# EAGLE design hand_foot_forearm_leg_LED (EAGLE 7.3.0)
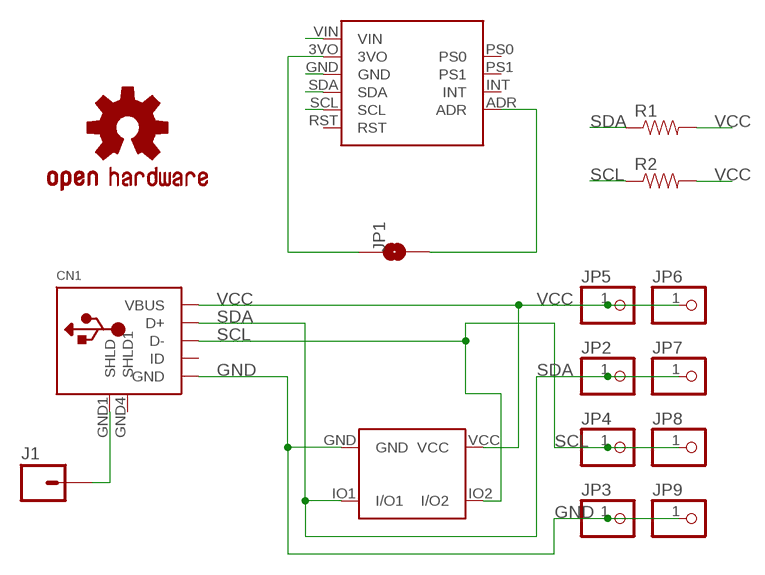
[diagram p0: schematic, sheet 1]

## Parts
CN1  USB  [USB-MINIB-THM-MOLEX_NOSLK]
J1  M01PTH  [1X01]
JP1  JUMPER-PAD-2-NO  [PAD-JUMPER-2-NO_NO_SILK]
JP2  PINHD-1X1CB  [1X01-CLEANBIG]
JP3  PINHD-1X1CB  [1X01-CLEANBIG]
JP4  PINHD-1X1CB  [1X01-CLEANBIG]
JP5  PINHD-1X1CB  [1X01-CLEANBIG]
JP6  PINHD-1X1CB  [1X01-CLEANBIG]
JP7  PINHD-1X1CB  [1X01-CLEANBIG]
JP8  PINHD-1X1CB  [1X01-CLEANBIG]
JP9  PINHD-1X1CB  [1X01-CLEANBIG]
LOGO1  OSHW-LOGOS  [OSHW-LOGO-S]
R1  RESISTORAXIAL-0.3  [AXIAL-0.3]
R2  RESISTORAXIAL-0.3  [AXIAL-0.3]
U$1  BNO_055_BKOUT  [BNO_BKOUT]
U$2  TVS_ARRAY_CD143A  [SOT-143]

## Nets
GND: CN1.GND JP3.1 JP9.1 U$1.GND U$2.GND
N$1: JP1.1 U$1.3VO
N$2: JP1.2 U$1.ADR
SCL: CN1.D- JP4.1 JP8.1 R2.P$1 U$1.SCL U$2.IO2(I/O2)
SDA: CN1.D+ JP2.1 JP7.1 R1.P$1 U$1.SDA U$2.IO1(I/O1)
SHIELD: CN1.GND1(SHLD) J1.1
VCC: CN1.VBUS JP5.1 JP6.1 R1.P$2 R2.P$2 U$1.VIN U$2.VCC
Unconnected: CN1.GND4(SHLD1) CN1.ID U$1.INT U$1.PS0 U$1.PS1 U$1.RST

## Library data of the parts
CN1 = adafruit:USB: USB Connectors USBMINIB - Surface Mount Female Mini-B USB Connector 4UConnector: 06564 By microbuilder.eu Thru-hole RA Female Mini-B USB Connector 4UConnector: 18732 By ladyada.net
J1 = SparkFun-Connectors:M01: Header 1 Standard 1-pin 0.1" header. Use with straight break away headers (SKU : PRT-00116), right angle break away headers (PRT-00553), swiss pins (PRT-00743), machine pins (PRT-00117), and female headers (PRT-00115). SMTSO-256-ET is a "flush mount" nut for a 4-40 screw. The older package used to be too tight, and did not allow it to sit properly thru the drill hit. The latest (0.165DIA) fits nice and snug.
JP1 = SparkFun-Passives:JUMPER-PAD-2-NO
JP2-JP9 = adafruit:PINHD-1X1: Pin header 1x1 for 0.1" spacing With round pins
LOGO1 = SparkFun-Aesthetics:OSHW-LOGO: Open Source Hardware Logo This logo indicates the piece of hardware it is found on incorporates a OSHW license and/or adheres to the definition of open source hardware found here: http://freedomdefined.org/OSHW
R1 R2 = SparkFun-Passives:RESISTOR: Resistor Basic schematic elements and footprints for 0603, 1206, and PTH resistors.
U$1 = skeleton:BNO_055_BKOUT
U$2 = skeleton:TVS_ARRAY_CD143A

## Board
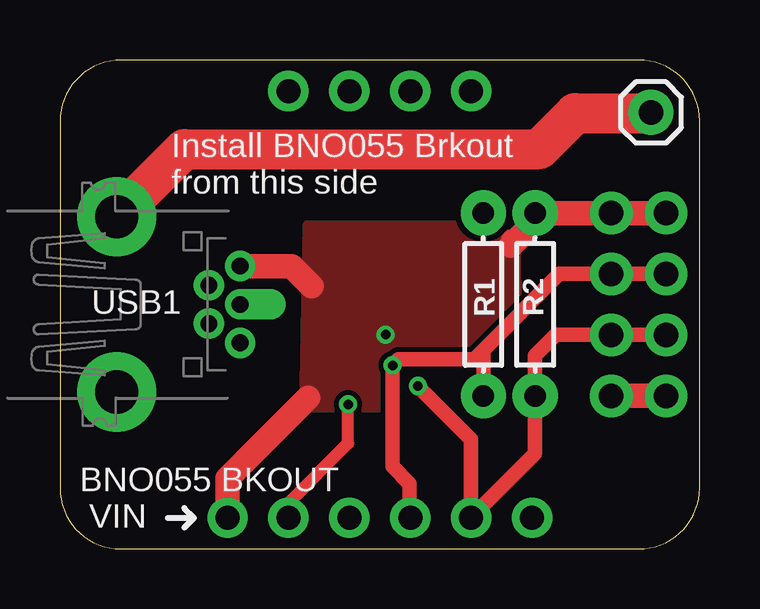
[diagram p1: board, top side]
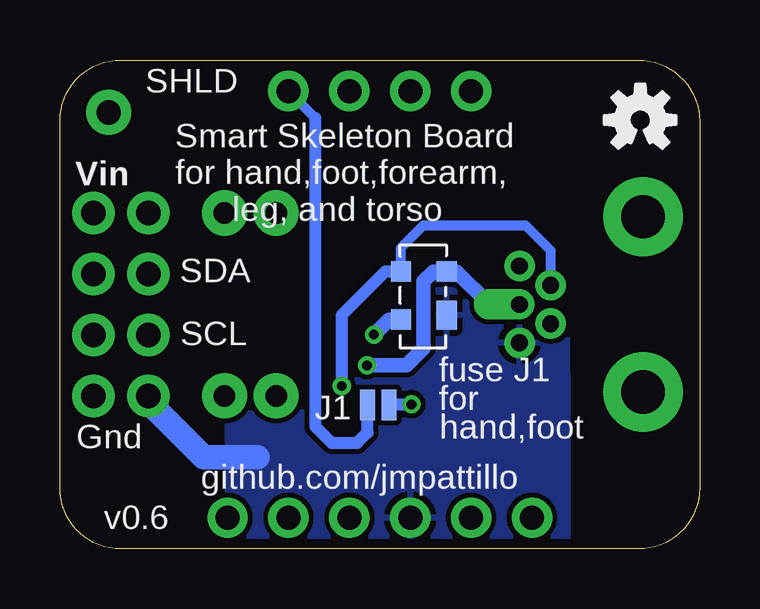
[diagram p2: board, bottom side, seen from below]

Size 26.67 x 20.37 mm. Coordinates in mm from the lower left corner, seen from the top.
Outline: 24.13,0 arc90 26.67,2.54 26.67,17.83 arc90 24.13,20.37 2.56,20.37 arc90 0,17.81 0,2.54 arc90 2.54,0 24.13,0
Copper layers (1*16): Top 0.0356mm / dielectric 1.5011mm / Bottom 0.0356mm
Design rules "LaenPCBOrder *": minimum track width 6mil, minimum drill 13mil, track to track 8mil, track to pad 7mil, pad to pad 8mil, via to via 8mil, smd to smd 8mil, copper to edge 15mil, drill to drill 6mil, minimum pad ring 7mil, minimum via ring 7mil, stop-mask expansion 3mil, vias tented up to drill 25mil, thermal gap 10mil

### Footprints (pad centres in the part's own frame; a part is rotated, then mirrored left to right if it is on the bottom)
USB-MINIB-THM-MOLEX_NOSLK = drill 0.7 pad 1.27 offset: D+ 0,9.72 | drill 0.7 pad 1.27: D- -0.8,8.42; GND 1.6,9.72; ID 0.8,8.42; VBUS -1.6,9.72 | drill 1.8 pad 3.302: GND1 -3.65,4.57; GND4 3.65,4.57
1X01 = drill 1.016 pad 1.88: 1 0,0
PAD-JUMPER-2-NO_NO_SILK = smd 0.635 x 1.27: 1 -0.45,0; 2 0.45,0
1X01-CLEANBIG = drill 1.016 pad 1.778: 1 0,0
AXIAL-0.3 = drill 0.9 pad 1.88: P$1 -3.81,0; P$2 3.81,0
BNO_BKOUT = drill 1 pad 1.676: 3VO -3.81,-8.89; ADR 3.81,8.89; GND -1.27,-8.89; INT 1.27,8.89; PS0 -3.81,8.89; PS1 -1.27,8.89; RST 6.35,-8.89; SCL 3.81,-8.89; SDA 1.27,-8.89; VIN -6.35,-8.89
SOT-143 = smd 1.2 x 0.85: GND -0.75,-0.95 | smd 0.85 x 0.85: IO1 1.075,-0.95; IO2 1.075,0.95; VCC -0.925,0.95

### Placement (x,y rotation side)
CN1  -2.21,10.19 270 top
J1  24.64,18.19 0 top
JP1  13.4,6 180 bottom
JP2  25.27,11.46 0 top
JP3  25.27,6.38 0 top
JP4  25.27,8.92 0 top
JP5  25.27,14 0 top
JP6  22.99,14 0 top
JP7  22.99,11.46 0 top
JP8  22.99,8.92 0 top
JP9  22.99,6.38 0 top
LOGO1  2.47,17.87 0 bottom
R1  17.65,10.19 90 top
R2  19.81,10.19 90 top
U$1  13.33,10.19 0 top
U$2  11.5,10.48 90 bottom

### Tracks (layer width: path | path; a pad name or v marks a point on that pad's centre or on a via)
GND
  Top 1.016: JP3.1 JP9.1
  Bottom 1.016: 18.44,3.81 20.68,3.81 22.99,6.12 JP9.1
  pour Bottom: 5.52,14.83 19.71,14.92 19.68,-0.13 5.49,-0.22
N$1  (via drill 0.4)
  Top 0.508: U$1.3VO 9.52,1.91 12.01,4.39 v12.01,6.02
  Bottom 0.508: JP1.1 12.94,6.02 v12.01,6.02
N$2
  Bottom 0.406: 16.03,17.96 U$1.ADR
  Bottom 0.508: 16.03,17.96 16.03,5.11 15.34,4.42 14.27,4.42 13.84,4.85 13.84,6 JP1.2
SCL  (via drill 0.4)
  Top 0.61: JP4.1 JP8.1 20.68,8.92 19.81,8.05 R2.P$1 19.81,3.96 U$1.SCL 17.15,4.56 v14.92,6.79
  Bottom 0.406: CN1.D- 6.21,12.43 7.24,13.47 11.53,13.47 12.47,12.52 12.47,11.58 U$2.IO2
  Bottom 0.508: v14.92,6.79 14.92,9.75 13.11,11.56 U$2.IO2
SDA  (via drill 0.4)
  Top 0.61: JP2.1 JP7.1 20.83,11.46 17.65,8.28 | U$1.SDA 14.58,1.32 14.58,2.72 13.85,3.44 13.85,7.63 v13.87,7.65 14.12,7.9 17.27,7.9 17.65,8.28 | R1.P$1 17.65,8.28
  Bottom 0.508: v13.86,7.64 v13.87,7.65
  Bottom 0.61: CN1.D+ 8.76,10.19 10.13,11.56 U$2.IO1 11.1,11.56 11.51,11.15 11.51,8.36 12.22,7.65 v13.87,7.65
SHIELD
  Top 1.676: CN1.GND1 5.19,16.66 19.99,16.66 21.49,18.16 24.61,18.16 J1.1
VCC  (via drill 0.4)
  Top 0.813: 18.82,12.9 18.8,12.88 18.8,12.62
  Top 1.016: U$1.VIN 6.98,2.95 10.34,6.3 | CN1.VBUS 9.65,11.79 10.49,10.95 | JP5.1 JP6.1 R2.P$2 19.81,13.64 18.8,12.62
  Bottom 0.61: U$2.VCC 12.95,9.56 v13.58,8.93
  pour Top: 10.27,13.57 19.08,13.58 19.17,7.18 16.08,7.16 15.9,7.14 13.46,7.14 13.46,5.79 10.12,5.77

### Text on the board
tPlace: Install BNO055 Brkout / from this side
tNames: USB1 | BNO055 BKOUT / VIN
bNames: SHLD | Vin | Smart Skeleton Board / for hand,foot,forearm, / leg, and torso | SDA | SCL | fuse J1 | for | J1 | hand,foot | Gnd | github.com/jmpattillo | v0.6